# EAGLE design W061B (EAGLE 6.6.0)
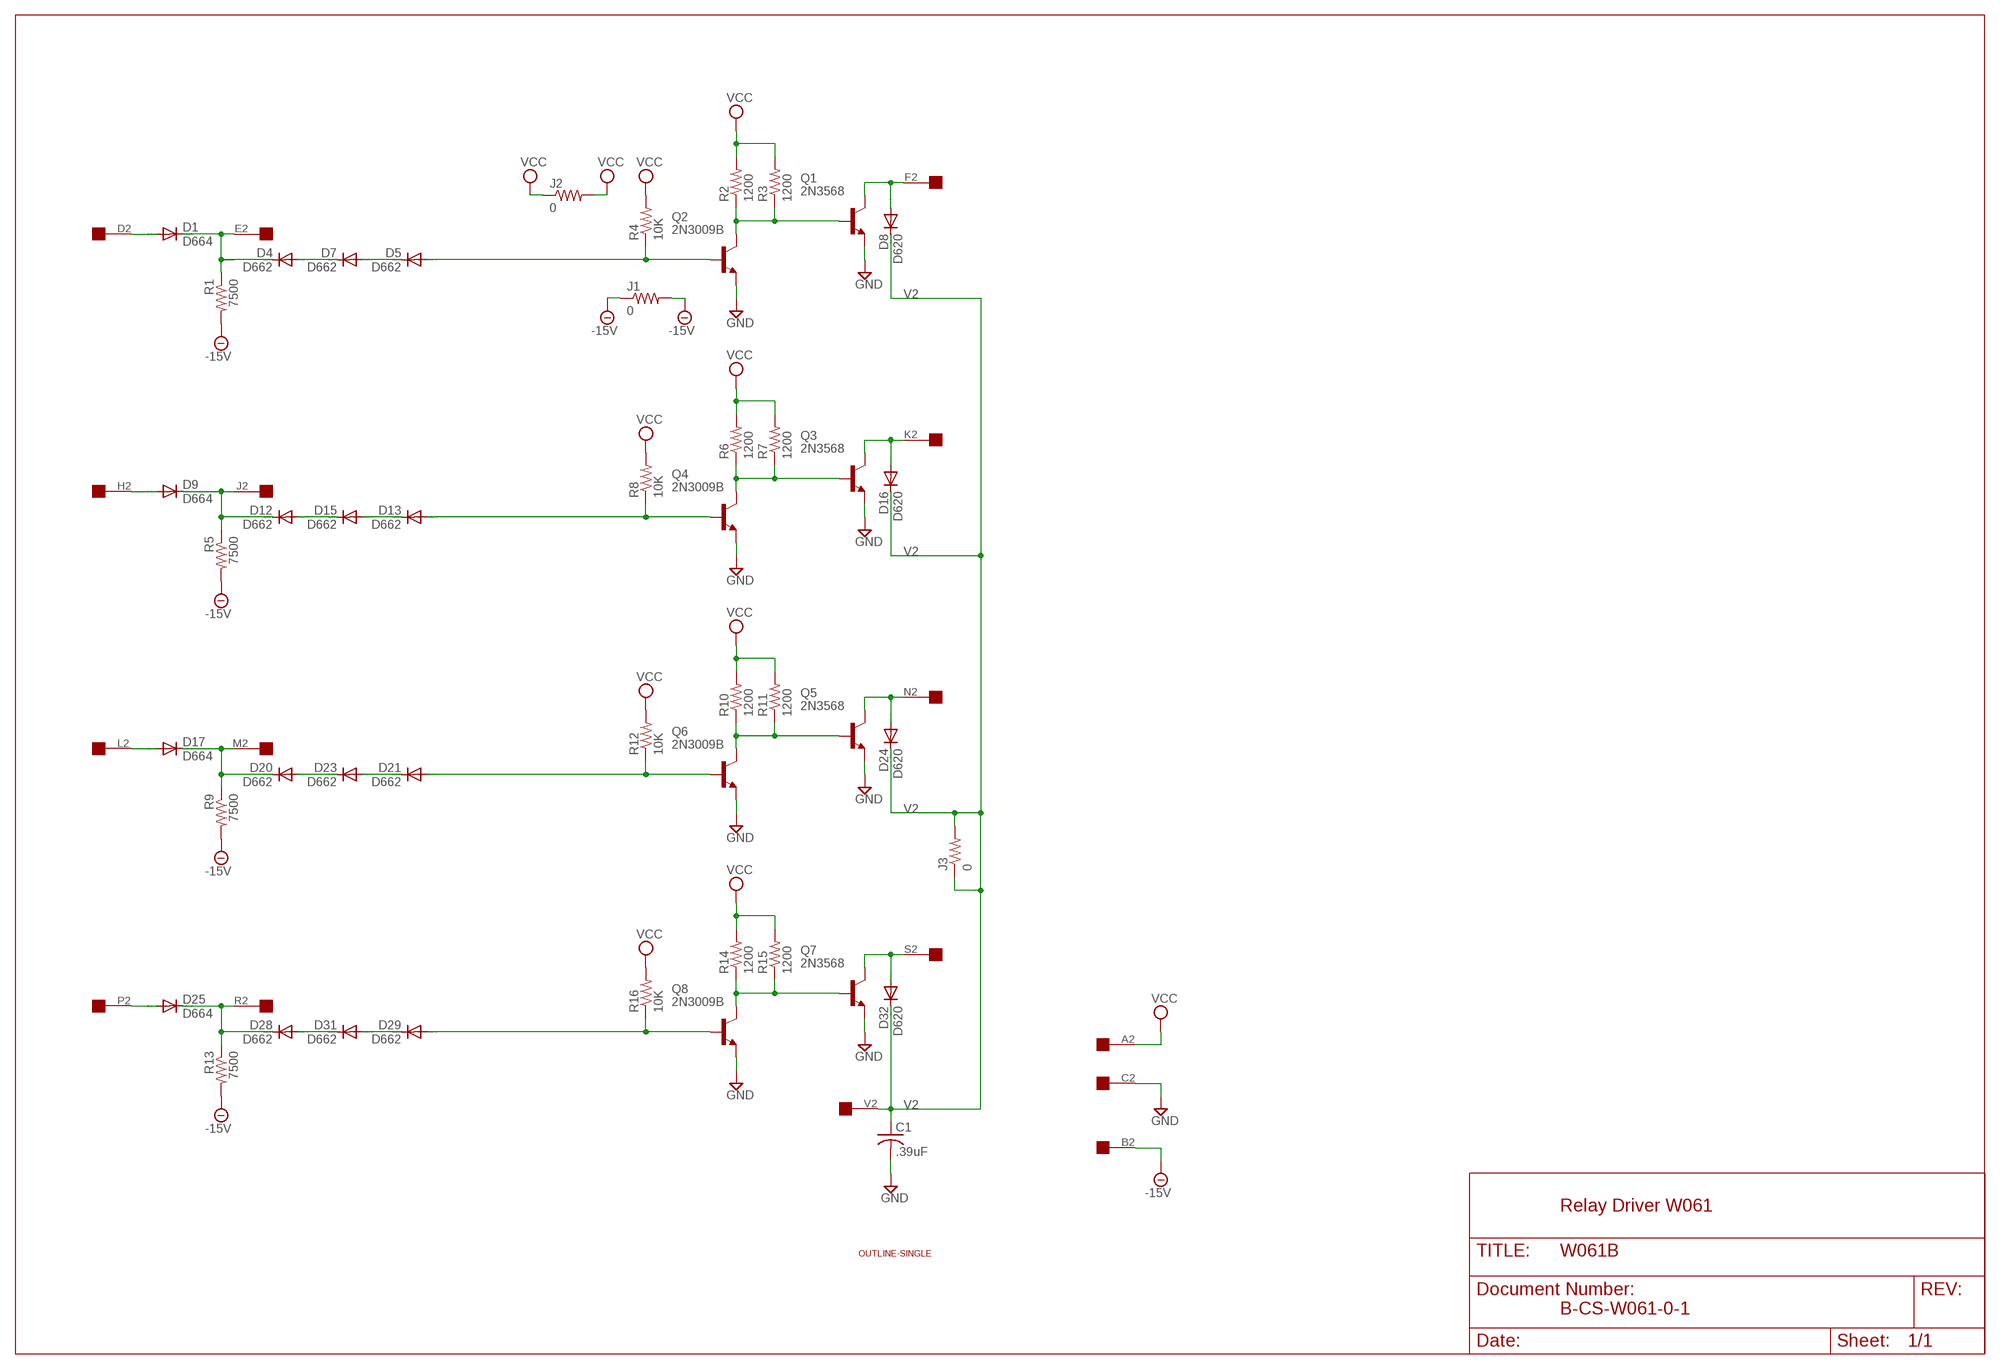
[diagram p0: schematic, sheet 1]

## Parts
C1  .39uF  C-US375-155X418  [C375-155X418]
D1  D664  DIODE-DO35-10  [DO35-10]
D4  D662  DIODE-DO35-10  [DO35-10]
D5  D662  DIODE-DO35-10  [DO35-10]
D7  D662  DIODE-DO35-10  [DO35-10]
D8  D620  DIODE-DO35-10  [DO35-10]
D9  D664  DIODE-DO35-10  [DO35-10]
D12  D662  DIODE-DO35-10  [DO35-10]
D13  D662  DIODE-DO35-10  [DO35-10]
D15  D662  DIODE-DO35-10  [DO35-10]
D16  D620  DIODE-DO35-10  [DO35-10]
D17  D664  DIODE-DO35-10  [DO35-10]
D20  D662  DIODE-DO35-10  [DO35-10]
D21  D662  DIODE-DO35-10  [DO35-10]
D23  D662  DIODE-DO35-10  [DO35-10]
D24  D620  DIODE-DO35-10  [DO35-10]
D25  D664  DIODE-DO35-10  [DO35-10]
D28  D662  DIODE-DO35-10  [DO35-10]
D29  D662  DIODE-DO35-10  [DO35-10]
D31  D662  DIODE-DO35-10  [DO35-10]
D32  D620  DIODE-DO35-10  [DO35-10]
J1  0  R-US_0207/10  [0207/10]
J2  0  R-US_0207/10  [0207/10]
J3  0  R-US_0207/10  [0207/10]
Q1  2N3568  -NPN-TO5  [TO5]
Q2  2N3009B  -NPN-TO5  [TO5]
Q3  2N3568  -NPN-TO5  [TO5]
Q4  2N3009B  -NPN-TO5  [TO5]
Q5  2N3568  -NPN-TO5  [TO5]
Q6  2N3009B  -NPN-TO5  [TO5]
Q7  2N3568  -NPN-TO5  [TO5]
Q8  2N3009B  -NPN-TO5  [TO5]
R1  7500  R-US_0207/10  [0207/10]
R2  1200  R-US_0207/10  [0207/10]
R3  1200  R-US_0207/10  [0207/10]
R4  10K  R-US_0207/10  [0207/10]
R5  7500  R-US_0207/10  [0207/10]
R6  1200  R-US_0207/10  [0207/10]
R7  1200  R-US_0207/10  [0207/10]
R8  10K  R-US_0207/10  [0207/10]
R9  7500  R-US_0207/10  [0207/10]
R10  1200  R-US_0207/10  [0207/10]
R11  1200  R-US_0207/10  [0207/10]
R12  10K  R-US_0207/10  [0207/10]
R13  7500  R-US_0207/10  [0207/10]
R14  1200  R-US_0207/10  [0207/10]
R15  1200  R-US_0207/10  [0207/10]
R16  10K  R-US_0207/10  [0207/10]
U$1  OUTLINE-SINGLE  [SINGLE]
U$2  EDGE-1  [EDGE-CON1]

## Nets
-15V: J1.1 J1.2 R1.2 R5.2 R9.2 R13.2 U$2.B2
D2: D1.A U$2.D2
E2: D1.C D4.C R1.1 U$2.E2
F2: D8.A Q1.3(C) U$2.F2
GND: C1.2 Q1.1(E) Q2.1(E) Q3.1(E) Q4.1(E) Q5.1(E) Q6.1(E) Q7.1(E) Q8.1(E) U$2.C2
H2: D9.A U$2.H2
J2: D9.C D12.C R5.1 U$2.J2
K2: D16.A Q3.3(C) U$2.K2
L2: D17.A U$2.L2
M2: D17.C D20.C R9.1 U$2.M2
N2: D24.A Q5.3(C) U$2.N2
N$1: D13.A Q4.2(B) R8.1
N$2: D5.A Q2.2(B) R4.1
N$3: D5.C D7.A
N$5: D13.C D15.A
N$6: D4.A D7.C
N$10: D12.A D15.C
N$13: Q3.2(B) Q4.3(C) R6.1 R7.1
N$16: Q1.2(B) Q2.3(C) R2.1 R3.1
N$18: D21.A Q6.2(B) R12.1
N$19: D21.C D23.A
N$21: D20.A D23.C
N$24: Q5.2(B) Q6.3(C) R10.1 R11.1
N$28: D29.A Q8.2(B) R16.1
N$29: D29.C D31.A
N$31: D28.A D31.C
N$34: Q7.2(B) Q8.3(C) R14.1 R15.1
P2: D25.A U$2.P2
R2: D25.C D28.C R13.1 U$2.R2
S2: D32.A Q7.3(C) U$2.S2
V2: C1.1 D8.C D16.C D24.C D32.C J3.1 J3.2 U$2.V2
VCC: J2.1 J2.2 R2.2 R3.2 R4.2 R6.2 R7.2 R8.2 R10.2 R11.2 R12.2 R14.2 R15.2 R16.2 U$2.A2
Unconnected: U$2.T2 U$2.U2

## Notes on the sheet
- Relay Driver W061
- B-CS-W061-0-1

## Library data of the parts
C1 = rcl:C-US: CAPACITOR, American symbol
D1 D4 D5 D7-D9 D12 D13 D15-D17 D20 D21 D23-D25 D28 D29 D31 D32 = diode:DIODE-: DIODE
J1-J3 R1-R16 = rcl:R-US_: RESISTOR, American symbol
Q1-Q8 = transistor:*-NPN-: NPN Transistror BF959 corrected 2008.03.06
U$1 = dec-con:OUTLINE-*: Board outlines for DEC boards.
U$2 = dec-con:EDGE-1: Single-Sided DEC Edge Connector -- (side 2)

## Board
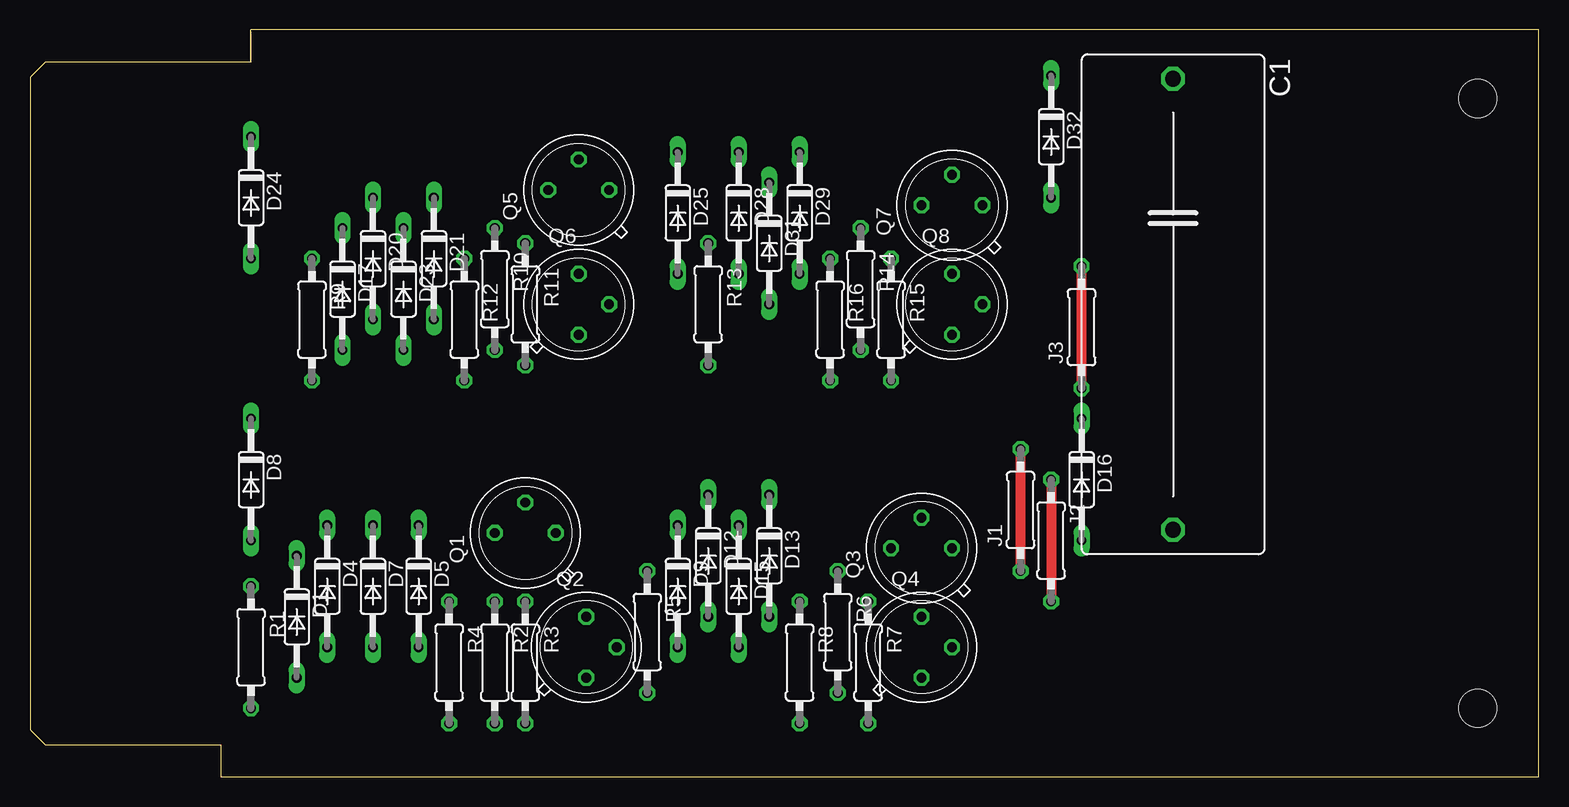
[diagram p1: board, top side]
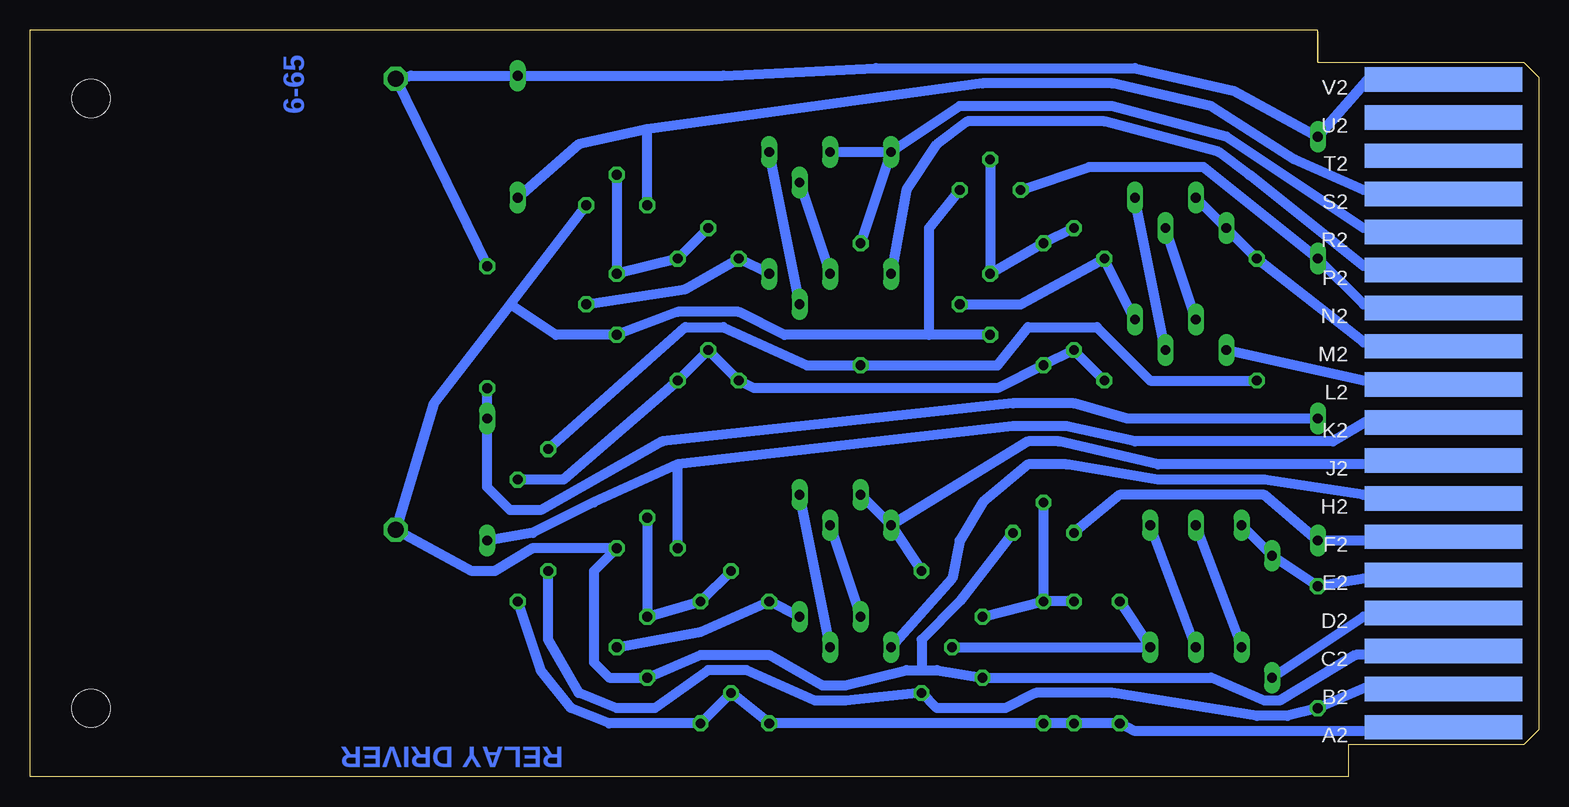
[diagram p2: board, bottom side, seen from below]

Size 125.73 x 62.23 mm. Coordinates in mm from the lower left corner, seen from the top.
Copper layers (1+16): Top 0.035mm / dielectric 1.5mm / Bottom 0.035mm
Design rules "16mils": minimum track width 16mil, minimum drill 32mil, track to track 15mil, track to pad 10mil, pad to pad 10mil, via to via 10mil, smd to smd 10mil, copper to edge 13mil, drill to drill 10mil, minimum pad ring 10mil, minimum via ring 8mil, stop-mask expansion 0mil, vias tented up to drill 0mil, thermal gap 10mil

### Footprints (pad centres in the part's own frame; a part is rotated, then mirrored left to right if it is on the bottom)
C375-155X418 = drill 1.321 octagon: 1 -18.796,0; 2 18.796,0
DO35-10 = drill 0.813 long: A 5.08,0; C -5.08,0
0207/10 = drill 0.813 octagon: 1 -5.08,0; 2 5.08,0
TO5 = drill 0.813 octagon: 1 0,-2.54; 2 2.54,0; 3 0,2.54
SINGLE = hole 3.175: 120.65,56.515; 120.65,5.715
EDGE-CON1 = smd 13.106 x 2.032 bottom: A2 7.938,4.128; B2 7.938,7.303; C2 7.938,10.477; D2 7.938,13.652; E2 7.938,16.828; F2 7.938,20.003; H2 7.938,23.177; J2 7.938,26.352; K2 7.938,29.527; L2 7.938,32.703; M2 7.938,35.877; N2 7.938,39.053; P2 7.938,42.227; R2 7.938,45.403; S2 7.938,48.578; T2 7.938,51.752; U2 7.938,54.928; V2 7.938,58.102

### Placement (x,y rotation side)
C1  95.25,39.37 270 top
D1  22.23,13.34 270 top
D4  24.77,15.88 270 top
D5  32.39,15.88 270 top
D7  28.58,15.88 270 top
D8  18.42,24.77 270 top
D9  53.98,15.88 270 top
D12  56.52,18.41 270 top
D13  61.6,18.41 270 top
D15  59.06,15.88 270 top
D16  87.63,24.77 270 top
D17  26.04,40.64 270 top
D20  28.58,43.18 270 top
D21  33.66,43.18 270 top
D23  31.12,40.64 270 top
D24  18.42,48.26 270 top
D25  53.98,46.99 270 top
D28  59.06,46.99 270 top
D29  64.14,46.99 270 top
D31  61.6,44.45 270 top
D32  85.09,53.34 270 top
J1  82.55,22.23 90 top
J2  85.09,19.68 270 top
J3  87.63,37.47 90 top
Q1  41.28,20.32 90 top
Q2  46.36,10.79 0 top
Q3  74.3,19.05 90 top
Q4  74.3,10.79 0 top
Q5  45.72,48.9 90 top
Q6  45.72,39.37 0 top
Q7  76.84,47.62 90 top
Q8  76.84,39.37 0 top
R1  18.42,10.79 270 top
R2  38.74,9.53 270 top
R3  41.28,9.53 270 top
R4  34.93,9.53 270 top
R5  51.44,12.06 270 top
R6  67.31,12.06 270 top
R7  69.85,9.53 270 top
R8  64.14,9.53 270 top
R9  23.5,38.1 270 top
R10  38.74,40.64 270 top
R11  41.28,39.37 270 top
R12  36.2,38.1 270 top
R13  56.52,39.37 270 top
R14  69.22,40.64 270 top
R15  71.76,38.1 270 top
R16  66.68,38.1 270 top
U$1  0,0 0 top
U$2  0,0 0 top

### Tracks (layer width: path | path; a pad name or v marks a point on that pad's centre or on a via)
-15V
  Top 0.813: J1.1 J1.2
  Bottom 0.813: J1.2 71.12,37.47 67.95,37.47 60.96,34.29 R13.2 45.09,34.29 42.55,37.47 36.83,37.47 32.39,33.02 R9.2 | U$2.B2 9.53,7.62 13.97,7.62 R1.2 20.96,5.08 23.5,5.08 35.56,6.99 41.91,6.99 44.45,5.71 50.17,5.71 R5.2 57.79,6.35 60.33,6.35 66.04,8.89 69.22,8.89 73.66,5.71 76.84,5.71 80.01,6.99 82.55,11.43 J1.1
D2
  Bottom 0.813: U$2.D2 8.26,13.34 14.61,13.34 D1.A
E2
  Bottom 0.813: D4.C D1.C R1.1 14.61,16.51 8.89,16.51 U$2.E2
F2
  Bottom 0.813: U$2.F2 8.89,19.68 D8.A 22.86,23.5 34.93,23.5 Q1.3
GND
  Bottom 0.813: Q6.1 50.8,36.83 | 50.8,36.83 50.8,45.72 Q5.1 | U$2.C2 8.89,10.16 15.24,10.16 21.59,6.35 22.86,6.35 27.31,8.26 Q2.1 50.17,8.89 51.44,8.89 | 51.44,8.89 52.71,8.89 57.79,7.62 59.69,7.62 64.14,10.16 69.85,10.16 Q4.1 77.47,8.26 78.74,9.53 78.74,17.14 Q3.1 83.82,19.05 87,17.14 88.9,17.14 C1.2 92.08,31.11 85.73,39.37 | Q1.1 48.26,14.61 51.44,11.43 51.44,8.89 | 85.73,39.37 81.92,36.83 Q8.1 71.76,38.73 66.68,38.73 62.87,36.83 50.8,36.83 | 85.73,39.37 Q7.1
H2
  Bottom 0.813: U$2.H2 9.53,23.5 14.61,23.5 22.86,24.77 31.75,24.77 39.37,26.04 42.55,26.04 46.36,22.86 48.26,19.68 48.9,16.51 D9.A
J2
  Bottom 0.813: R5.1 D9.C | D9.C D12.C | U$2.J2 8.89,26.04 31.75,26.04 40.01,27.94 42.55,27.94 D9.C
K2
  Bottom 0.813: Q3.3 71.76,26.04 | 71.76,26.04 78.74,22.86 83.82,20.32 D16.A | U$2.K2 8.89,29.84 13.97,29.84 17.15,27.94 33.66,27.94 39.37,29.21 43.82,29.21 71.76,26.04
L2
  Bottom 0.813: U$2.L2 8.89,33.02 14.61,33.02 D17.A
M2
  Bottom 0.813: D20.C D17.C R9.1 14.61,36.2 8.26,36.2 U$2.M2
N2
  Bottom 0.813: U$2.N2 8.26,39.37 14.61,39.37 D24.A 27.94,50.8 37.47,50.8 Q5.3
N$1
  Bottom 0.813: D13.A R8.1 69.85,12.06 Q4.2
N$2
  Bottom 0.813: R4.1 D5.A Q2.2
N$3
  Bottom 0.813: D7.A D5.C
N$5
  Bottom 0.813: D15.A D13.C
N$6
  Bottom 0.813: D7.C D4.A
N$10
  Bottom 0.813: D15.C D12.A
N$13
  Bottom 0.813: Q3.2 Q4.3 R7.1 R6.1
N$16
  Bottom 0.813: R2.1 R3.1 | Q1.2 R3.1 | Q2.3 R3.1
N$18
  Bottom 0.813: D21.A R12.1 43.18,39.37 Q6.2
N$19
  Bottom 0.813: D23.A D21.C
N$21
  Bottom 0.813: D23.C D20.A
N$24
  Bottom 0.813: R10.1 R11.1 Q6.3 Q5.2
N$28
  Bottom 0.813: D29.A R16.1 71.12,40.64 Q8.2
N$29
  Bottom 0.813: D31.A D29.C
N$31
  Bottom 0.813: D28.A D31.C
N$34
  Bottom 0.813: R14.1 R15.1 Q8.3 Q7.2
P2
  Bottom 0.813: U$2.P2 8.26,42.55 14.61,42.55 24.13,50.16 26.67,52.07 36.2,54.61 47.63,54.61 50.17,52.7 52.71,48.9 D25.A
R2
  Bottom 0.813: R13.1 D25.C | D28.C D25.C | U$2.R2 8.26,45.72 14.61,45.72 26.04,53.34 35.56,55.88 48.26,55.88 D25.C
S2
  Bottom 0.813: Q7.3 74.3,53.98 | 74.3,53.98 80.01,52.7 D32.A | U$2.S2 9.53,48.9 14.61,48.9 20.32,51.44 27.31,55.88 35.56,57.78 46.36,57.78 74.3,53.98
V2
  Top 0.813: J3.1 J3.2
  Bottom 0.813: J3.1 D16.C 87.63,24.13 85.73,22.23 83.19,22.23 73.03,27.94 43.82,31.11 38.74,31.11 34.29,29.84 D8.C | J3.2 C1.1 93.98,58.42 D32.C 67.95,58.42 55.25,59.05 33.66,59.05 25.4,57.15 D24.C 13.97,58.42 9.53,58.42 U$2.V2
VCC
  Top 0.813: J2.1 J2.2
  Bottom 0.813: U$2.A2 8.89,3.81 33.66,3.81 R4.2 R2.2 R3.2 R8.2 R6.2 R7.2 77.47,4.45 80.65,5.71 83.19,8.89 J2.2 | J2.1 81.28,24.77 R15.2 R14.2 R16.2 65.41,32.38 45.09,32.38 R11.2 R10.2 R12.2

### Text on the board
Bottom: 6-65 | RELAY DRIVER